# EAGLE design XBeeV2 (EAGLE 6.5.0)
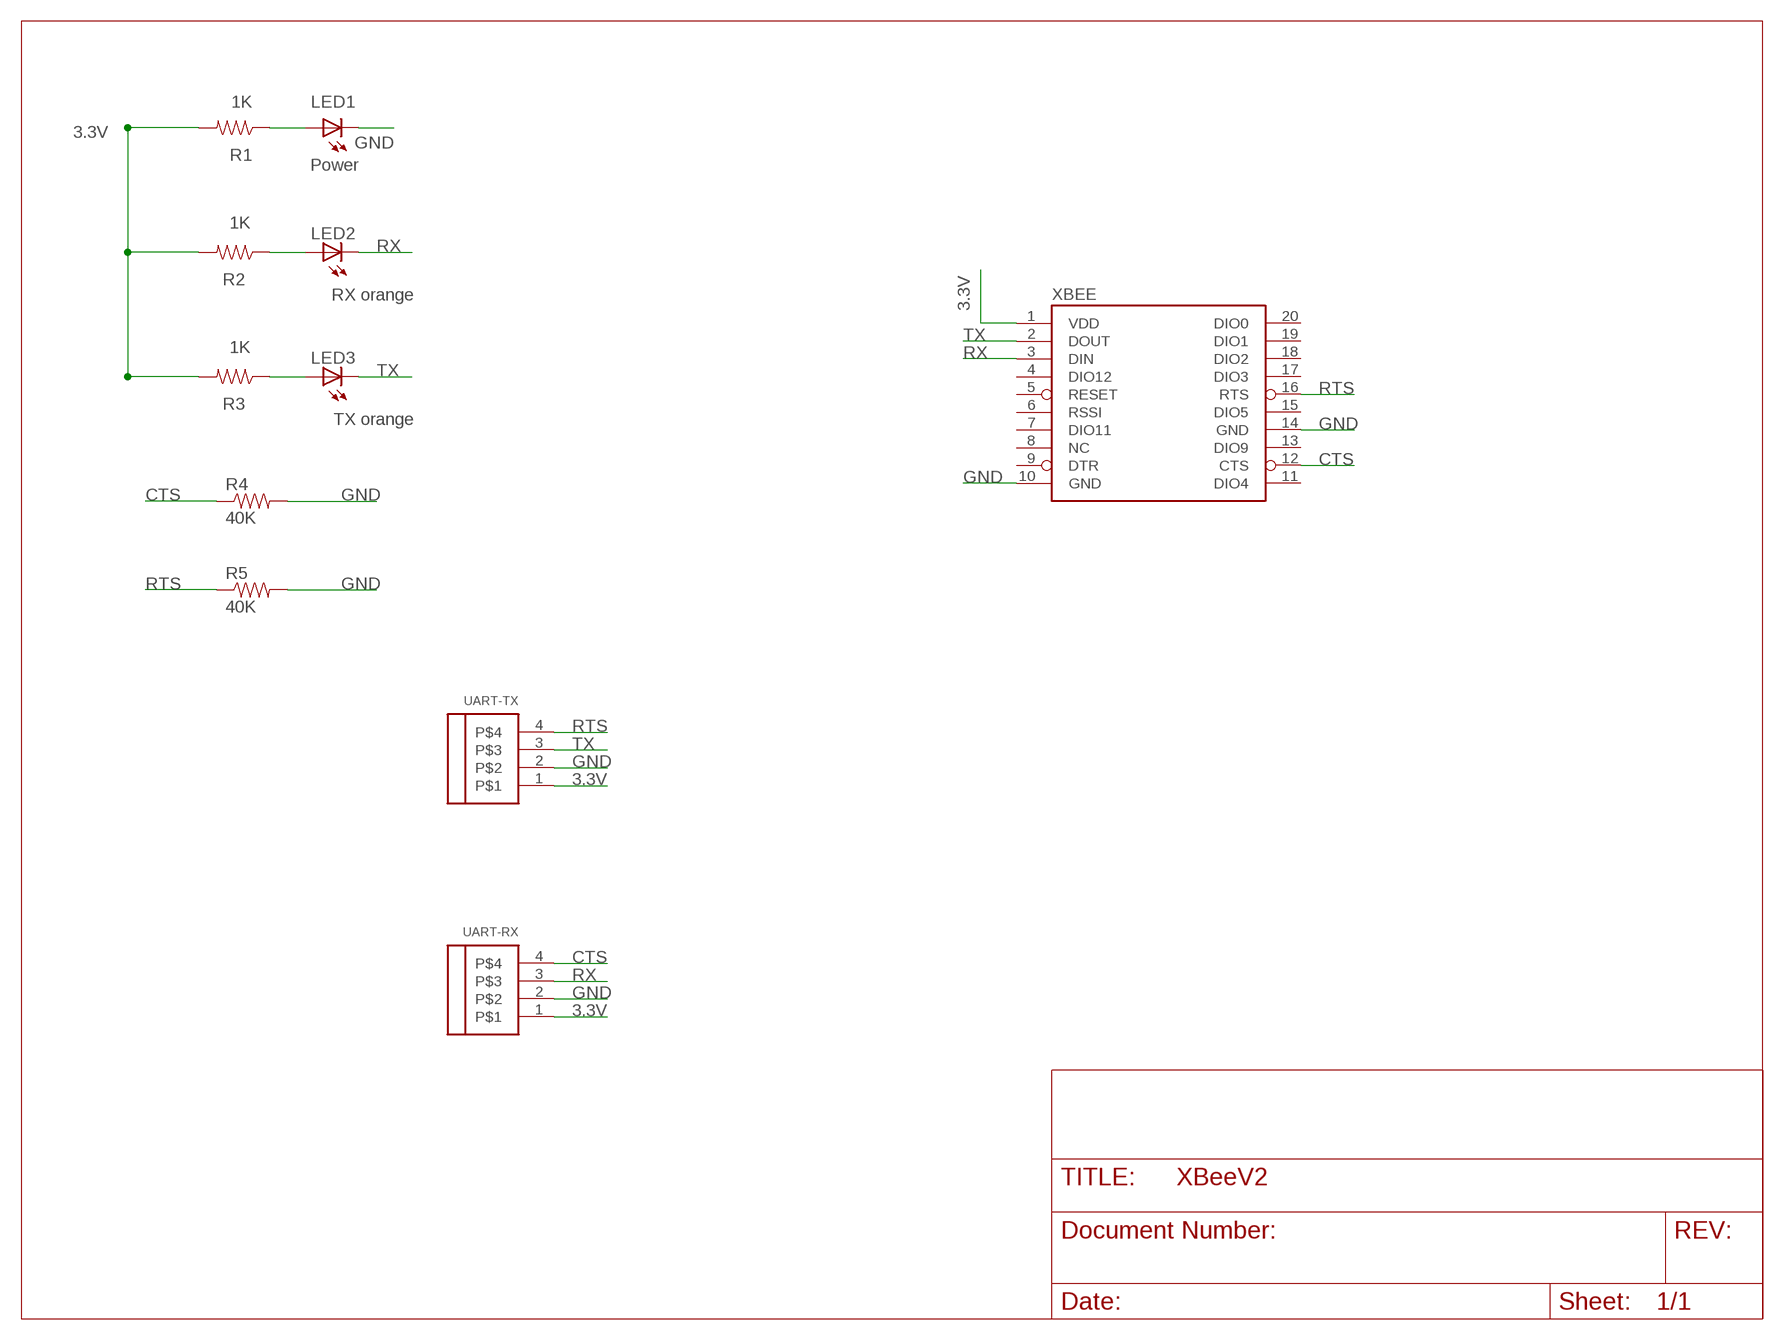
[diagram p0: schematic, sheet 1]

## Parts
LED1  Power  LED_SMD_1206  [1206_INCH-HS-LED]
LED2  RX orange  LED_SMD_1206  [1206_INCH-HS-LED]
LED3  TX orange  LED_SMD_1206  [1206_INCH-HS-LED]
R1  1K  RESISTOR_0805  [0805_INCH-HS]
R2  1K  RESISTOR_0805  [0805_INCH-HS]
R3  1K  RESISTOR_0805  [0805_INCH-HS]
R4  40K  RESISTOR_0805  [0805_INCH-HS]
R5  40K  RESISTOR_0805  [0805_INCH-HS]
UART-RX  HEADER-04_JST-ZH_JST-ZH  [1X04-JST-ZH]
UART-TX  HEADER-04_JST-ZH_JST-ZH  [1X04-JST-ZH]
XBEE  XBEELOCK-SMALL-PRINT  [XBEE-1_LOCK]

## Nets
3.3V [PWR]: R1.2 R2.2 R3.2 UART-RX.1 UART-TX.1 XBEE.1(VDD)
CTS: R4.1 UART-RX.4 XBEE.12(CTS)
GND [PWR]: LED1.C R4.2 R5.2 UART-RX.2 UART-TX.2 XBEE.10(GND) XBEE.14(GND)
N$1: LED3.A R3.1
N$2: LED2.A R2.1
N$3: LED1.A R1.1
RTS: R5.1 UART-TX.4 XBEE.16(RTS)
RX: LED2.C UART-RX.3 XBEE.3(DIN)
TX: LED3.C UART-TX.3 XBEE.2(DOUT)
Unconnected: XBEE.4(DIO12) XBEE.5(RESET) XBEE.6(RSSI) XBEE.7(DIO11) XBEE.8(NC) XBEE.9(DTR) XBEE.11(DIO4) XBEE.13(DIO9) XBEE.15(DIO5) XBEE.17(DIO3) XBEE.18(DIO2) XBEE.19(DIO1) XBEE.20(DIO0)

## Library data of the parts
LED1-LED3 = AZ Custom:LED: LEDs Standard schematic elements and footprints for 5mm, 3mm, 1206, and 0603 sized LEDs. 5mm - Spark Fun Electronics SKU : COM-00529 (and others)
R1-R5 = AZ Custom:RESISTOR
UART-RX UART-TX = AZ Custom:HEADER-04
XBEE = AZ Custom:XBEE

## Net classes
0 default: width 0.203 mm, clearance 0.203 mm
2 PWR: width 0.406 mm, clearance 0.406 mm

## Board
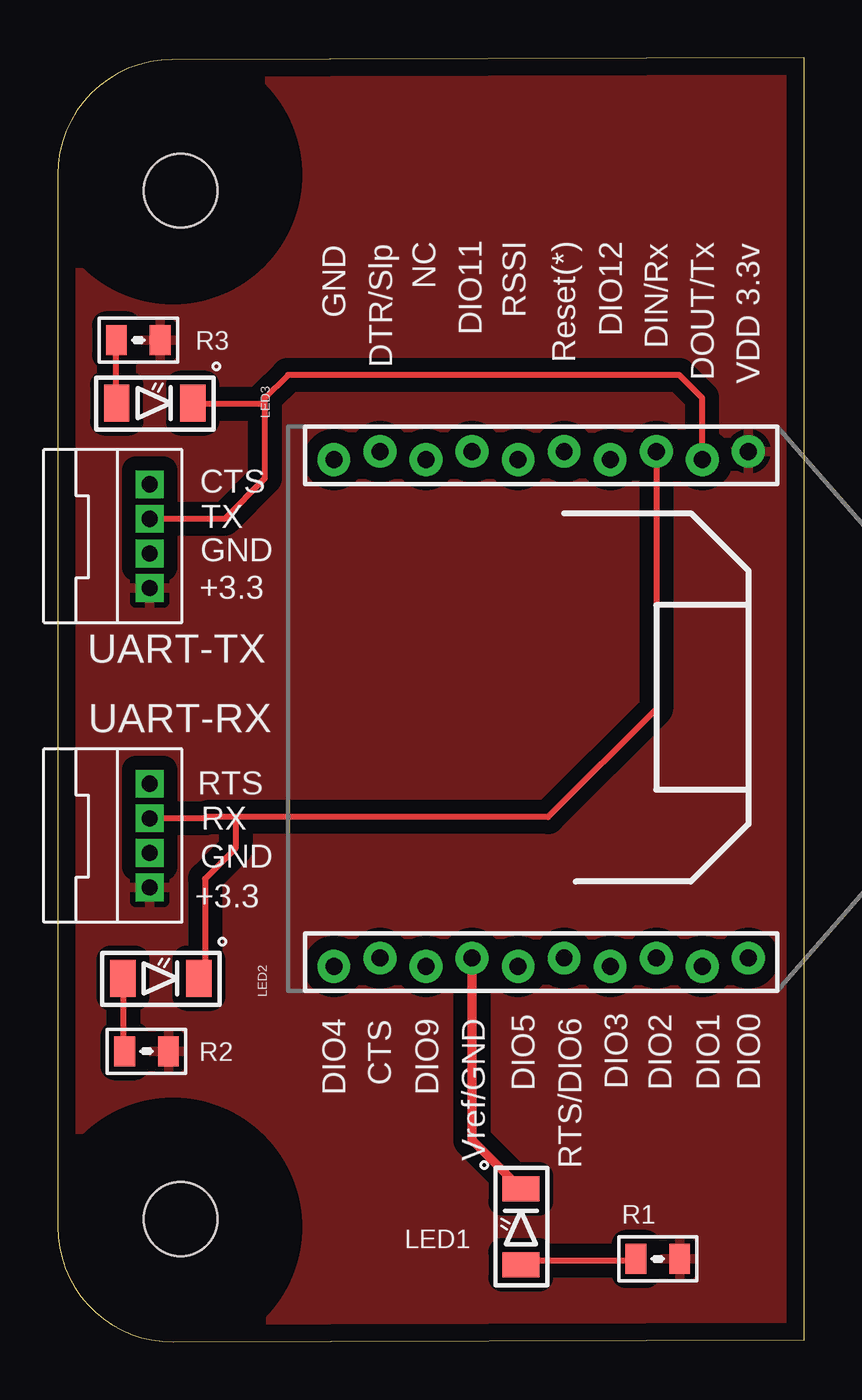
[diagram p1: board, top side]
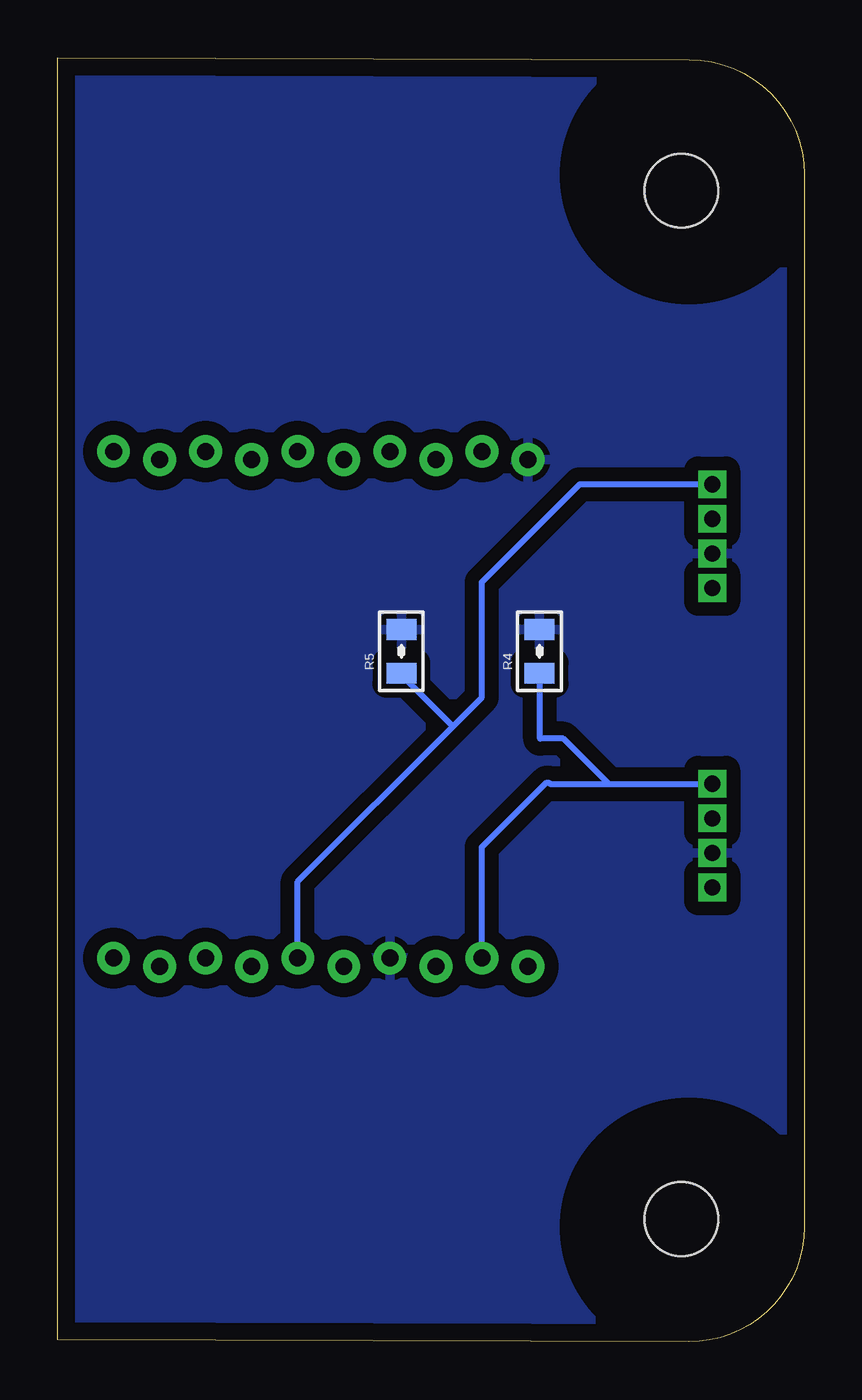
[diagram p2: board, bottom side, seen from below]

Size 32.43 x 55.76 mm. Coordinates in mm from the lower left corner, seen from the top.
Outline: 32.43,55.76 4.99,55.68 arc90 0,50.68 0,5 arc90 5.01,0 32.43,0.08 32.43,55.76
Copper layers (1*16): Top 0.035mm / dielectric 1.5mm / Bottom 0.035mm
Design rules "AZCustom *": minimum track width 10mil, minimum drill 16mil, track to track 8mil, track to pad 8mil, pad to pad 8mil, via to via 8mil, smd to smd 8mil, copper to edge 30mil, drill to drill 12mil, minimum pad ring 10mil, minimum via ring 8mil, stop-mask expansion 4mil, vias tented up to drill 25mil, thermal gap 10mil
Holes 3.2 mm at 5.35,5.33 5.35,49.98
tRestrict: area 0,0 to 10,10; area 0,45.7 to 10,55.7
bRestrict: area 0,45.7 to 10,55.7; area 0,0 to 10,10

### Footprints (pad centres in the part's own frame; a part is rotated, then mirrored left to right if it is on the bottom)
1206_INCH-HS-LED = smd 1.1 x 1.6: A -1.65,0; C 1.65,0
0805_INCH-HS = smd 0.9 x 1.3: 1 -0.95,0; 2 0.95,0
1X04-JST-ZH = drill 0.7 pad 0.991 square: 1 -2.25,0; 2 -0.75,0; 3 0.75,0; 4 2.25,0
XBEE-1_LOCK = drill 0.737 pad 1.422: 1 -11.178,20; 2 -10.822,18; 3 -11.178,16; 4 -10.822,14; 5 -11.178,12; 6 -10.822,10; 7 -11.178,8; 8 -10.822,6; 9 -11.178,4; 10 -10.822,2; 11 11.178,2; 12 10.822,4; 13 11.178,6; 14 10.822,8; 15 11.178,10; 16 10.822,12; 17 11.178,14; 18 10.822,16; 19 11.178,18; 20 10.822,20

### Placement (x,y rotation side)
LED1  20.12,5 90 top
LED2  4.49,15.79 0 top
LED3  4.22,40.76 0 top
R1  26.07,3.6 0 top
R2  3.86,12.62 0 top
R3  3.5,43.49 0 top
R4  11.5,29.98 90 bottom
R5  17.5,29.98 90 bottom
UART-RX  4,21.98 90 top
UART-TX  4,34.98 90 top
XBEE  10,27.48 270 top

### Tracks (layer width: path | path; a pad name or v marks a point on that pad's centre or on a via)
3.3V
  pour Top (isolate 0.61): 31.75,-0.02 5,-0.02 arc-90 0,4.98 0,50.86 arc-90 5,55.86 31.75,55.86
CTS
  Bottom 0.254: XBEE.12 14,21.48 11.2,24.28 11.1,24.28 11.05,24.23 8.53,24.23 | 8.53,24.23 UART-RX.4 | R4.1 11.48,28.94 11.48,26.2 10.46,26.2 8.53,24.27 8.53,24.23
GND
  Top 0.406: LED1.C 18,8.77 XBEE.14
  pour Bottom (isolate 0.61): 31.75,-0.02 5,-0.02 arc-90 0,4.98 0,50.86 arc-90 5,55.86 31.75,55.86
N$1
  Top 0.254: R3.1 2.54,43.47 2.54,40.83 LED3.A
N$2
  Top 0.254: R2.1 2.85,12.68 2.85,15.02 2.74,15.12 2.74,15.73 LED2.A
N$3
  Top 0.254: R1.1 25.09,3.54 20.22,3.54 20.22,3.44 LED1.A
RTS
  Bottom 0.254: XBEE.16 22,19.98 15.26,26.72 | 15.26,26.72 14,27.98 14,32.98 9.75,37.23 UART-TX.4 | 15.26,26.72 17.48,28.94 R5.1
RX
  Top 0.254: XBEE.3 26,27.48 21.3,22.78 7.72,22.78 | 7.72,22.78 6.5,22.78 6.45,22.73 UART-RX.3 | 7.72,22.78 7.72,21.42 6.4,20.1 6.4,16.04 6.2,15.83 LED2.C
TX
  Top 0.254: XBEE.2 28,40.98 27,41.98 10,41.98 9,40.98 9,40.73 | 9,40.73 9,37.48 7.25,35.73 UART-TX.3 | 9,40.73 5.89,40.73 LED3.C

### Text on the board
tPlace: CTS | TX | GND | +3.3 | UART-TX | RTS | RX | GND | +3.3